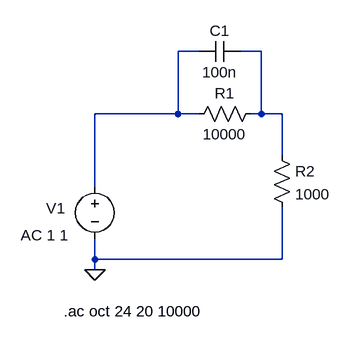
[diagram p0: schematic shelf filter.asc]
shelf filter.asc, the LTspice schematic file:
Version 4
SHEET 1 880 680
WIRE 144 0 112 0
WIRE 240 0 208 0
WIRE 112 96 112 0
WIRE 112 96 -16 96
WIRE 144 96 112 96
WIRE 240 96 240 0
WIRE 240 96 224 96
WIRE 272 96 240 96
WIRE 272 160 272 96
WIRE -16 208 -16 96
WIRE -16 320 -16 288
WIRE 272 320 272 240
WIRE 272 320 -16 320
WIRE -16 336 -16 320
FLAG -16 336 0
SYMBOL res 240 80 R90
WINDOW 0 0 56 VBottom 0
WINDOW 3 32 56 VTop 0
SYMATTR InstName R1
SYMATTR Value 10000
SYMBOL voltage -16 192 R0
WINDOW 0 -75 49 Left 0
WINDOW 123 -114 91 Left 0
WINDOW 39 0 0 Left 0
SYMATTR InstName V1
SYMATTR Value2 AC 1 1
SYMATTR Value ""
SYMBOL res 256 144 R0
SYMATTR InstName R2
SYMATTR Value 1000
SYMBOL cap 208 -16 R90
WINDOW 0 0 32 VBottom 0
WINDOW 3 32 32 VTop 0
SYMATTR InstName C1
SYMATTR Value 100n
TEXT -64 400 Left 0 !.ac oct 24 20 10000

The netlist it stands for:
* shelf filter.asc
R1 N002 N001 10000
V1 N001 0 AC 1 1
R2 N002 0 1000
C1 N002 N001 100n
.ac oct 24 20 10000
.backanno
.end